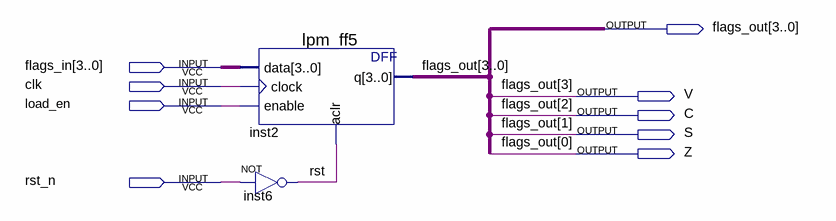
[diagram p0: schematic sheet]
// Quartus schematic fr_unit.bdf as structural Verilog: 2 symbols, 9 pins
module fr_unit (
  input  [3:0] flags_in,
  input  clk,
  input  load_en,
  input  rst_n,
  output [3:0] flags_out,
  output V,
  output C,
  output S,
  output Z
);

  wire rst;

  lpm_ff5 inst2 (.data(flags_in), .clock(clk), .enable(load_en), .aclr(rst), .q({flags_out[3], C, flags_out[1:0]}));
  not inst6 (rst, rst_n);

  assign flags_out[2] = C;
  assign S = flags_out[1];
  assign V = flags_out[3];
  assign Z = flags_out[0];
endmodule
